# EAGLE design board-beta2.0v (EAGLE 7.7.0)
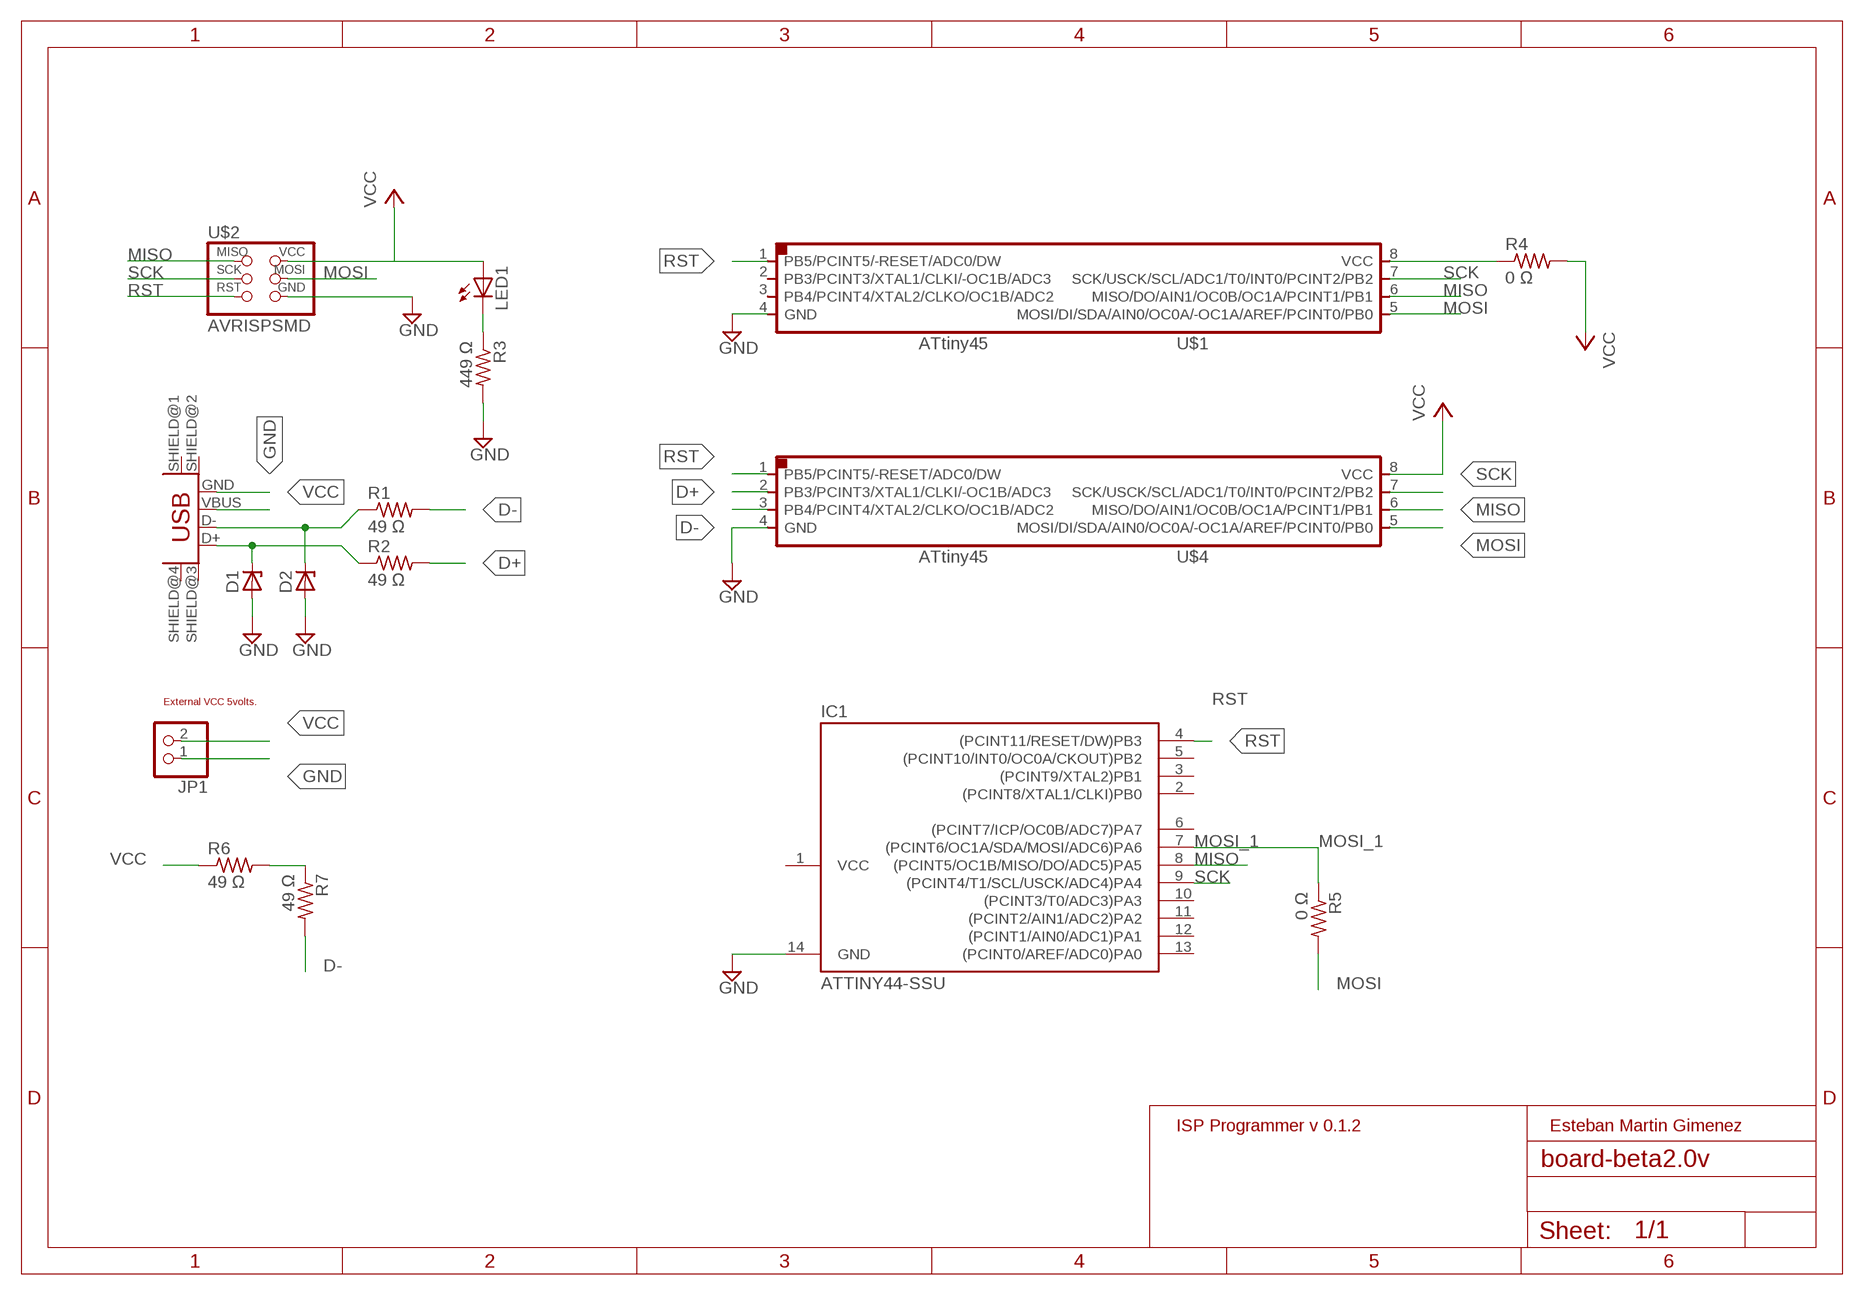
[diagram p0: schematic, sheet 1]

## Parts
D1  ZENER_DIODESOD123  [SOD123]
D2  ZENER_DIODESOD123  [SOD123]
IC1  ATTINY44-SSU  [SOIC14]
JP1  PINHD-1X2  [1X02]
LED1  LEDCHIPLED_1206  [CHIPLED_1206]
R1  49 Ω  RES-US1206FAB  [R1206FAB]
R2  49 Ω  RES-US1206FAB  [R1206FAB]
R3  449 Ω  RES-US1206FAB  [R1206FAB]
R4  0 Ω  RES-US1206FAB  [R1206FAB]
R5  0 Ω  RES-US1206FAB  [R1206FAB]
R6  49 Ω  RES-US1206FAB  [R1206FAB]
R7  49 Ω  RES-US1206FAB  [R1206FAB]
U$1  ATTINY45SI  [SOIC8]
U$2  AVRISPSMD  [2X03SMD]
U$4  ATTINY45SI  [SOIC8]
U$5  USB_MINIB  [USB_MINIB]

## Nets
_D+: D1.CATHODE R2.1 U$5.D+
_D-: D2.CATHODE R1.1 U$5.D-
D+: R2.2 U$4.2(PB3/PCINT3/XTAL1/CLKI/-OC1B/ADC3)
D-: R1.2 R7.2 U$4.3(PB4/PCINT4/XTAL2/CLKO/OC1B/ADC2)
GND: D1.ANODE D2.ANODE IC1.14(GND) JP1.1 R3.2 U$1.4(GND) U$2.6(GND) U$4.4(GND) U$5.GND
MISO: IC1.8((PCINT5/OC1B/MISO/DO/ADC5)PA5) U$1.6(MISO/DO/AIN1/OC0B/OC1A/PCINT1/PB1) U$2.1(MISO) U$4.6(MISO/DO/AIN1/OC0B/OC1A/PCINT1/PB1)
MOSI: R5.2 U$1.5(MOSI/DI/SDA/AIN0/OC0A/-OC1A/AREF/PCINT0/PB0) U$2.4(MOSI) U$4.5(MOSI/DI/SDA/AIN0/OC0A/-OC1A/AREF/PCINT0/PB0)
MOSI_1: IC1.7((PCINT6/OC1A/SDA/MOSI/ADC6)PA6) R5.1
N$1: R4.1 U$1.8(VCC)
N$3: LED1.C R3.1
N$4: U$4.8(VCC) ; supply symbol labelled VCC
N$5: R6.2 R7.1
RST: IC1.4((PCINT11/RESET/DW)PB3) U$1.1(PB5/PCINT5/-RESET/ADC0/DW) U$2.5(RST) U$4.1(PB5/PCINT5/-RESET/ADC0/DW)
SCK: IC1.9((PCINT4/T1/SCL/USCK/ADC4)PA4) U$1.7(SCK/USCK/SCL/ADC1/T0/INT0/PCINT2/PB2) U$2.3(SCK) U$4.7(SCK/USCK/SCL/ADC1/T0/INT0/PCINT2/PB2)
VCC: JP1.2 LED1.A R4.2 R6.1 U$2.2(VCC) U$5.VBUS
Unconnected: IC1.2((PCINT8/XTAL1/CLKI)PB0) IC1.3((PCINT9/XTAL2)PB1) IC1.5((PCINT10/INT0/OC0A/CKOUT)PB2) IC1.6((PCINT7/ICP/OC0B/ADC7)PA7) IC1.10((PCINT3/T0/ADC3)PA3) IC1.11((PCINT2/AIN1/ADC2)PA2) IC1.12((PCINT1/AIN0/ADC1)PA1) IC1.13((PCINT0/AREF/ADC0)PA0) U$1.2(PB3/PCINT3/XTAL1/CLKI/-OC1B/ADC3) U$1.3(PB4/PCINT4/XTAL2/CLKO/OC1B/ADC2) U$5.SHIELD@1(SHIELD) U$5.SHIELD@2(SHIELD1) U$5.SHIELD@3(SHIELD2) U$5.SHIELD@4(SHIELD3)

## Notes on the sheet
- External VCC 5volts.
- ISP Programmer v 0.1.2 | Esteban Martin Gimenez

## Power pins joined to a net without a drawn wire
VCC: IC1.1(VCC)

## Library data of the parts
D1 D2 = fab:ZENER_DIODE: zener diode
IC1 = fab:ATTINY44
JP1 = pinhead:PINHD-1X2: PIN HEADER
LED1 = adafruit:LED: LED OSRAM: - CHIPLED LG R971, LG N971, LY N971, LG Q971, LY Q971, LO R971, LY R971 LH N974, LH R974 LS Q976, LO Q976, LY Q976 LO Q996 - Hyper CHIPLED LW Q18S LB Q993, LB Q99A, LB R99A - SideLED LS A670, LO A670, LY A670, LG A670, LP A670 LB A673, LV A673, LT A673, LW A673 LH A674 LY A675 LS A676, LA A676, LO A676, LY A676, LW A676 LS A679, LY A679, LG A679 - Hyper Micro SIDELED® LS Y876, LA Y876, LO Y876, LY Y876 LT Y87S - SmartLED LW L88C, LW L88S LB L89C, LB L89S, LG L890 LS L89K, LO L89K, LY L89K LS L896, LA L896, LO L896, LY L896 - TOPLED LS T670, LO T670, LY T670, LG T670, LP T670 LSG T670, LSP T670, LSY T670, LOP T670, LYG T670 LG T671, LOG T671, LSG T671 LB T673, LV T673, LT T673, LW T673 LH T674 LS T676, LA T676, LO T676, LY T676, LB T676, LH T676, LSB T676, LW T676 LB T67C, LV T67C, LT T67C, LS T67K, LO T67K, LY T67K, LW E67C LS E67B, LA E67B, LO E67B, LY E67B, LB E67C, LV E67C, LT E67C LW T67C LS T679, LY T679, LG T679 LS T770, LO T770, LY T770, LG T770, LP T770 LB T773, LV T773, LT T773, LW T773 LH T774 LS E675, LA E675, LY E675, LS T675 LS T776, LA T776, LO T776, LY T776, LB T776 LHGB T686 LT T68C, LB T68C - Hyper Mini TOPLED® LB M676 - Mini TOPLED Santana® LG M470 LS M47K, LO M47K, LY M47K Source: http://www.osram.convergy.de/
R1-R7 = fab:RES-US: Resistor (US Symbol) Variants with postfix FAB are widened to allow the routing of internal traces
U$1 U$4 = fab:ATTINY45
U$2 = fab:AVRISP
U$5 = fab:USB_MINIB

## Board
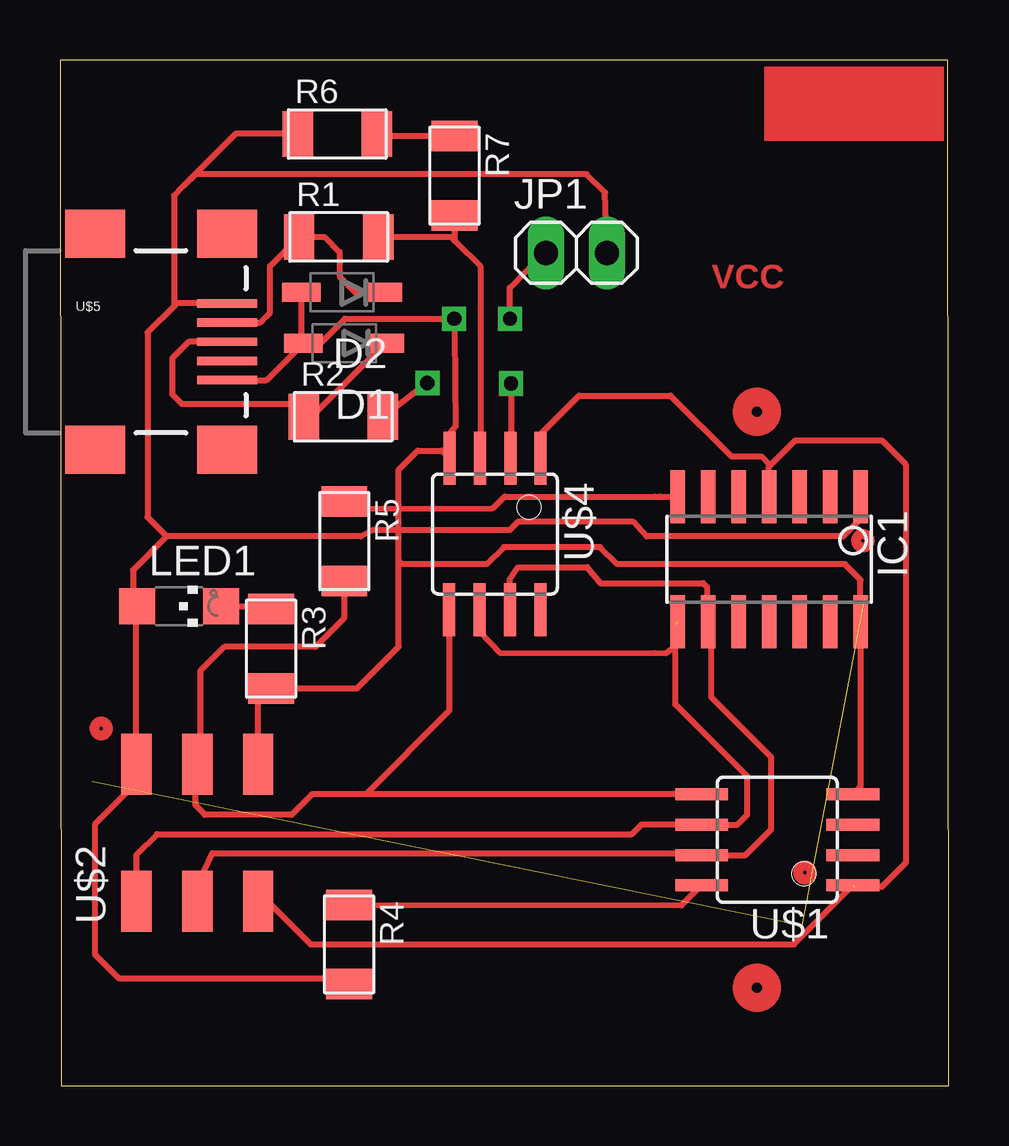
[diagram p1: board, top side]
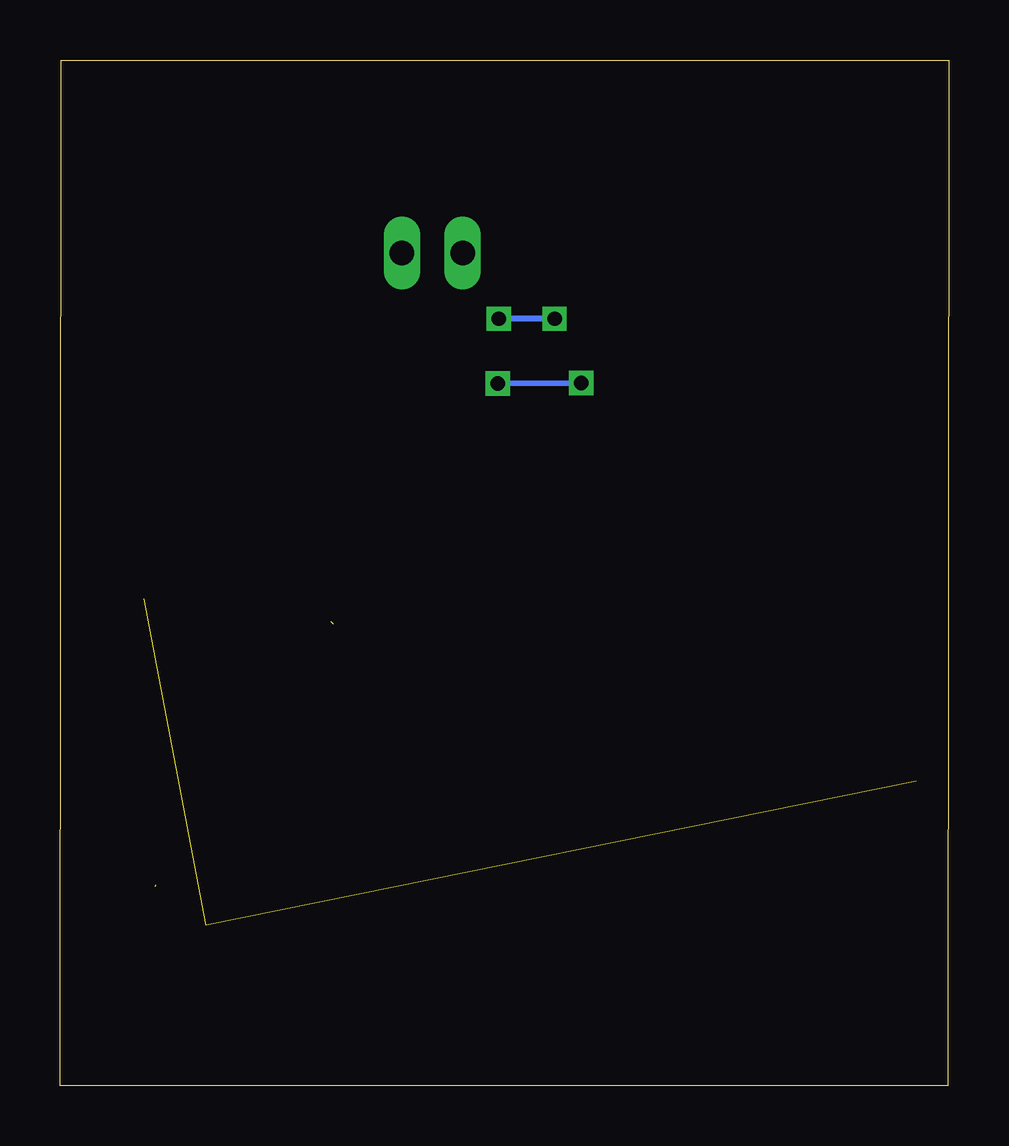
[diagram p2: board, bottom side, seen from below]

Size 37.05 x 42.73 mm. Coordinates in mm from the lower left corner, seen from the top.
Outline: 0.05,0 37.05,0 37,42.73 0,42.73 0.05,0
Copper layers (1*16): Top 0.035mm / dielectric 1.5mm / Bottom 0.035mm
Design rules "board12_1_3_5v *": minimum track width 10mil, minimum drill 24mil, track to track 8mil, track to pad 8mil, pad to pad 8mil, via to via 8mil, smd to smd 8mil, copper to edge 40mil, drill to drill 8mil, minimum pad ring 10mil, minimum via ring 8mil, stop-mask expansion 4mil, vias tented up to drill 0mil, thermal gap 10mil

### Footprints (pad centres in the part's own frame; a part is rotated, then mirrored left to right if it is on the bottom)
SOD123 = smd 1.6 x 0.8: ANODE 1.7,0; CATHODE -1.7,0
SOIC14 = smd 0.61 x 2.21: 1 -3.81,-2.603; 2 -2.54,-2.603; 3 -1.27,-2.603; 4 0,-2.603; 5 1.27,-2.603; 6 2.54,-2.603; 7 3.81,-2.603; 8 3.81,2.603; 9 2.54,2.603; 10 1.27,2.603; 11 0,2.603; 12 -1.27,2.603; 13 -2.54,2.603; 14 -3.81,2.603
1X02 = drill 1.016 long: 1 -1.27,0; 2 1.27,0
CHIPLED_1206 = smd 1.5 x 1.5: A 0,-1.75; C 0,1.75
R1206FAB = smd 1.27 x 1.905: 1 -1.651,0; 2 1.651,0
SOIC8 = smd 0.5 x 2.2: 1 -1.905,-3.154; 2 -0.645,-3.154; 3 0.625,-3.154; 4 1.895,-3.154; 5 1.905,3.154; 6 0.635,3.154; 7 -0.635,3.154; 8 -1.905,3.154
2X03SMD = smd 2.54 x 1.27: 1 -2.857,2.54; 2 2.857,2.54; 3 -2.857,0; 4 2.857,0; 5 -2.857,-2.54; 6 2.857,-2.54
USB_MINIB = smd 2.5 x 0.35: D+ 3.77,0; D- 3.77,0.8; GND 3.77,-1.6; ID 3.77,-0.8; VBUS 3.77,1.6 | smd 2.5 x 2: SHIELD@1 -1.73,-4.5; SHIELD@2 -1.73,4.5; SHIELD@3 3.77,4.5; SHIELD@4 3.77,-4.5

### Placement (x,y rotation side)
D1  11.85,30.93 180 top
D2  11.76,33.05 180 top
IC1  29.56,21.93 180 top
JP1  21.53,34.69 0 top
LED1  4.97,19.97 270 top
R1  11.62,35.36 0 top
R2  11.81,27.87 0 top
R3  8.8,18.2 270 top
R4  12.05,5.88 270 top
R5  11.85,22.68 270 top
R6  11.56,39.65 0 top
R7  16.45,37.91 270 top
U$1  29.9,10.24 90 top
U$2  5.72,10.53 90 top
U$4  18.13,22.98 180 top
U$5  3.19,30.99 0 top

### Tracks (layer width: path | path; a pad name or v marks a point on that pad's centre or on a via)
_D+
  Top 0.254: D1.CATHODE 10.49,27.87 R2.1 9.63,28.4 5.08,28.4 4.68,28.8 4.68,30.3 5.37,30.99 U$5.D+
_D-
  Top 0.254: U$5.D- 8.34,31.79 8.6,32.05 8.61,32.05 8.75,32.19 8.75,34.14 R1.1 11.03,35.36 11.66,34.73 11.66,33.7 12.35,33.01 13.42,33.01 D2.CATHODE
D+  (via drill 0.6)
  Top 0.25: R2.2 15.28,29.27 v15.32,29.27 | v18.8,29.25 18.8,26.66 U$4.2
  Bottom 0.25: v15.32,29.27 v18.8,29.25
D-
  Top 0.25: R1.2 16.3,35.36 16.5,35.16 17.53,34.13 17.53,26.76 U$4.3
  Top 0.254: R7.2 16.45,35.21 16.5,35.16
GND  (via drill 0.6)
  Top 0.25: U$2.6 8.26,16.24 R3.2 | IC1.14 33.37,12.45 U$1.4
  Top 0.254: D2.ANODE 10.06,31.02 D1.ANODE | U$5.GND 8.61,29.39 D1.ANODE | D1.ANODE 10.86,30.93 11.88,31.95 v16.43,31.95 16.46,31.32 16.51,27.49 16.31,27.25 16.31,26.33 16.19,26.45 15.92,26.45 | v18.76,31.95 18.75,33.25 20.21,34.75 JP1.1 | R3.2 12.38,16.55 14.12,18.29 14.12,21.87 | 14.12,21.87 14.12,25.66 14.91,26.45 15.92,26.45 | 15.92,26.45 U$4.4 | IC1.14 33.37,21.07 32.72,21.72 23.23,21.72 22.52,22.43 18.5,22.43 17.79,21.72 14.27,21.72 14.12,21.87
  Bottom 0.254: v16.43,31.95 v18.76,31.95
MISO  (1 unrouted)
  Top 0.25: U$2.1 3.18,9.61 4.05,10.48 23.85,10.48 24.25,10.88 U$1.6 28.25,10.88 28.65,11.28 28.65,12.88 25.65,15.88 25.65,19.23 | U$4.6 17.5,18.93 18.37,18.02 24.78,18.03 25.27,18.02 25.74,18.37 IC1.8
MOSI
  Top 0.25: U$1.5 12.75,12.15 | 12.75,12.15 10.51,12.15 9.65,11.28 6.05,11.28 5.65,11.68 5.65,13.48 | 5.65,13.48 5.65,13.68 5.85,13.88 | R5.2 11.85,19.48 10.65,18.28 6.85,18.28 5.85,17.28 5.85,13.68 | 5.85,13.68 5.85,13.52 | U$2.4 5.72,13.55 | 5.72,13.55 5.85,13.68 | 5.72,13.55 5.65,13.48 | U$4.5 16.22,15.62 12.75,12.15
MOSI_1
  Top 0.25: R5.1 12.26,24.02 18.05,24.06 18.54,24.54 24.81,24.54 25,24.53 IC1.7
N$1
  Top 0.25: R4.1 25.91,7.5 U$1.8
N$2  (2 unrouted)
N$3
  Top 0.25: LED1.C 8.45,19.97 R3.1
N$5
  Top 0.254: R7.1 13.44,39.56 R6.2
RST  (1 unrouted)
  Top 0.25: U$2.5 8.66,7.67 10.45,5.88 30.6,5.88 U$1.1 | IC1.4 29.56,25.79 29.62,25.85 | 29.62,25.85 30.65,26.88 34.25,26.88 35.25,25.88 35.25,9.28 34.25,8.28 33.11,8.28 | U$4.1 20.04,27.14 21.64,28.75 25.45,28.75 27.99,26.21 29.26,26.21 29.62,25.85
SCK
  Top 0.25: U$2.3 5.72,7.61 5.85,7.48 5.85,8.22 5.72,8.35 6.35,9.68 25.97,9.68 U$1.7 28.57,9.61 29.65,10.68 29.65,13.68 27.15,16.18 27.15,19.2 IC1.9 26.95,19.4 26.97,20.78 26.81,20.93 23.15,20.92 22.54,20.92 21.97,21.6 19.09,21.59 18.76,21.1 18.77,20.49 U$4.7
VCC
  Top 0.25: 4.45,22.88 12.55,22.88 13.03,23.14 18.74,23.14 19.1,23.5 23.9,23.49 24.45,22.88 32.65,22.88 33.37,23.6 IC1.1 | 4.45,22.88 3.05,21.48 3.05,20.14 LED1.A 3.18,19.93 U$2.2 3.18,12.61 1.45,10.88 1.45,5.48 2.45,4.48 12.07,4.48 | 12.87,4.48 12.07,4.48 | 12.07,4.48 R4.2 | U$5.VBUS 4.86,32.59 4.75,32.48 | 4.75,32.48 3.65,31.38 3.65,23.68 4.45,22.88 | JP1.2 22.72,37.21 21.95,37.98 5.65,37.98 5.14,37.47 4.75,37.08 4.75,32.48
  Top 0.254: R6.1 7.33,39.66 5.14,37.47
(copper drawn outside any net)
  shapes: Top area x1, Top circle x5

### Text on the board
Top: VCC
Pads: Boot